# Altium schematic sheet Four_DDS.SchDoc
size A; SheetNumber: 11; SheetTotal: 16
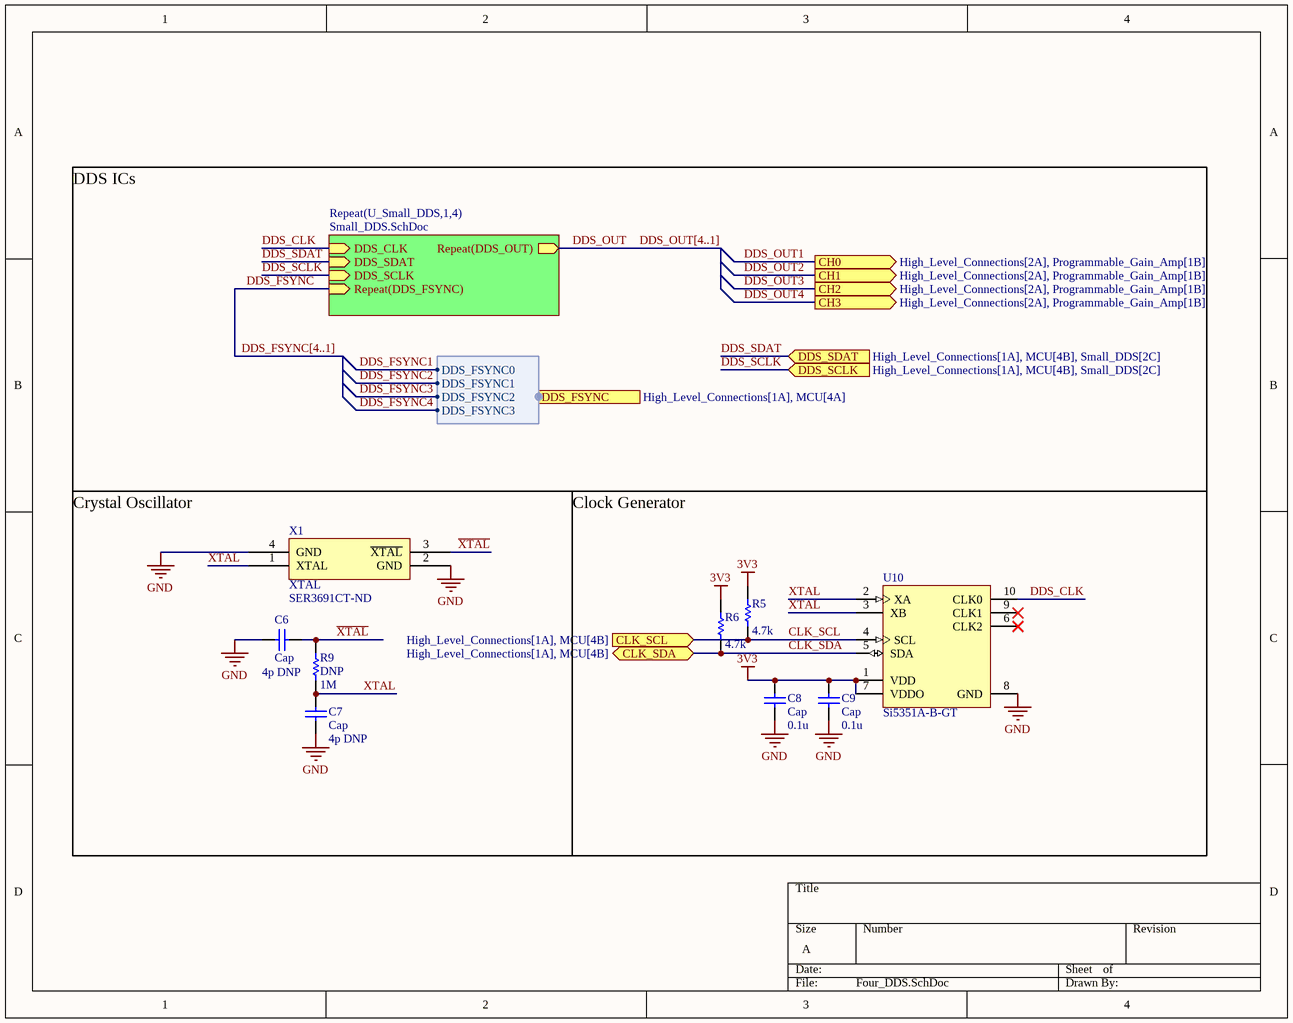
[diagram p0: Four_DDS.SchDoc]

## Parts
C6  Cap  value 4p DNP  [0402_Res]
C7  Cap  value 4p DNP  [0402_Res]
C8  Cap  value 0.1u  [0402_Res]
C9  Cap  value 0.1u  [0402_Res]
R5  value 4.7k  [0402_Res]  (hidden comment: DNP)
R6  value 4.7k  [0402_Res]  (hidden comment: DNP)
R9  DNP  value 1M  [0402_Res]
U10  Si5351A-B-GT  [SLAB-MSOP-10_N]
X1  XTAL  Supplier Part Number 1: SER3691CT-ND  [XTAL_Basic]

## Blocks framed on the sheet
Clock Generator: C8 C9 R5 R6 U10

## Sub-sheets
Repeat(U_Small_DDS,1,4) = Small_DDS.SchDoc: DDS_CLK (in), DDS_SDAT (in), DDS_SCLK (in), Repeat(DDS_FSYNC) (in), Repeat(DDS_OUT) (out)

## Ports
CH0 (out, see High_Level_Connections[2A], Programmable_Gain_Amp[1B]), CH1 (out, see High_Level_Connections[2A], Programmable_Gain_Amp[1B]), CH2 (out, see High_Level_Connections[2A], Programmable_Gain_Amp[1B]), CH3 (out, see High_Level_Connections[2A], Programmable_Gain_Amp[1B]), CLK_SCL (in, see High_Level_Connections[1A], MCU[4B]), CLK_SDA (bidir, see High_Level_Connections[1A], MCU[4B]), DDS_FSYNC (harness DDS_FSYNC, see High_Level_Connections[1A], MCU[4A]), DDS_SCLK (in, see High_Level_Connections[1A], MCU[4B], Small_DDS[2C]), DDS_SDAT (in, see High_Level_Connections[1A], MCU[4B], Small_DDS[2C])

## Harnesses
DDS_FSYNC: DDS_FSYNC0, DDS_FSYNC1, DDS_FSYNC2, DDS_FSYNC3

## Nets
3V3: C8.2 C9.2 R5.2 R6.2 U10.1(VDD) U10.7(VDDO)
GND: C6.1 C7.1 C8.1 C9.1 U10.8(GND) X1.2(GND) X1.4(GND)
~{XTAL}: C6.2 R9.2 U10.3(XB) X1.3(~{XTAL})
CLK_SCL: R5.1 U10.4(SCL) ; port CLK_SCL
CLK_SDA: R6.1 U10.5(SDA) ; port CLK_SDA
DDS_CLK: U10.10(CLK0) ; sheet Repeat(U_Small_DDS,1,4)/DDS_CLK
DDS_FSYNC: sheet Repeat(U_Small_DDS,1,4)/Repeat(DDS_FSYNC)
DDS_FSYNC1: port DDS_FSYNC.DDS_FSYNC0
DDS_FSYNC2: port DDS_FSYNC.DDS_FSYNC1
DDS_FSYNC3: port DDS_FSYNC.DDS_FSYNC2
DDS_FSYNC4: port DDS_FSYNC.DDS_FSYNC3
DDS_OUT: sheet Repeat(U_Small_DDS,1,4)/Repeat(DDS_OUT)
DDS_OUT1: port CH0
DDS_OUT2: port CH1
DDS_OUT3: port CH2
DDS_OUT4: port CH3
DDS_SCLK: port DDS_SCLK, sheet Repeat(U_Small_DDS,1,4)/DDS_SCLK
DDS_SDAT: port DDS_SDAT, sheet Repeat(U_Small_DDS,1,4)/DDS_SDAT
XTAL: C7.2 R9.1 U10.2(XA) X1.1(XTAL)

Not connected (* = marked no-connect by the designer): U10 6(CLK2)* 9(CLK1)*

## Buses and harness runs
bus DDS_FSYNC[4..1]
bus DDS_OUT[4..1]

## Notes on the sheet
- DDS ICs
- Crystal Oscillator

## Library data of the parts
C6-C9 = Cap: Capacitor; Published: 8-Jun-2000; LatestRevisionDate: 17-Jul-2002; LatestRevisionNote: Re-released for DXP Platform.; PackageReference: RAD-0.3; Publisher: Altium Limited; PackageDescription: Radial Cap, Thru-Hole; 2 Leads; 0.3 in Pin Spacing
R5 R6 R9 = Res1: Resistor; Published: 8-Jun-2000; LatestRevisionDate: 17-Jul-2002; LatestRevisionNote: Re-released for DXP Platform.; PackageReference: AXIAL-0.3; Publisher: Altium Limited; PackageDescription: Axial Device, Thru-Hole; 2 Leads; 0.3 in Pin Spacing
U10 = CMP-0510-00012-1: I2C-Programmable Any-Frequency CMOS Clock Generator + VCXO, 2.5 / 3.3 V, 0.008 to 160 MHz Output, -40 to 85 degC, 10-pin SOP; Manufacturer: Silicon Labs; Sub-Family: Clock Generators; VDD: 2.5 V; 3.3 V; Output Format: LVCMOS; Reference Inputs: 1; ComponentLink1URL: http://www.silabs.com/; Code_JEDEC: MO-187; PackageDescription: 10-Pin Mini Small Outline Package, Body 3 x 3 mm, Pitch 0.5 mm; Output Frequency (MHz): 0.008 to 160; ComponentLink3Description: Package Specification; DatasheetVersion: Rev. 0.95; PartNumber: Si5351A-B-GT; ComponentLink1Description: Manufacturer URL; Code_IPC: J-STD-020; Mounting Technology: Surface Mount; ComponentLink2Description: Datasheet; PackageReference: MSOP-10; ComponentLink2URL: http://www.silabs.com/Support%20Documents/TechnicalDocs/Si5351.pdf; ComponentLink3URL: http://www.silabs.com/Support Documents/TechnicalDocs/C8051T60x.pdf
X1 = XTAL: ComponentLink1Description: New link; ComponentLink1URL: *; Supplier 1: DigiKey